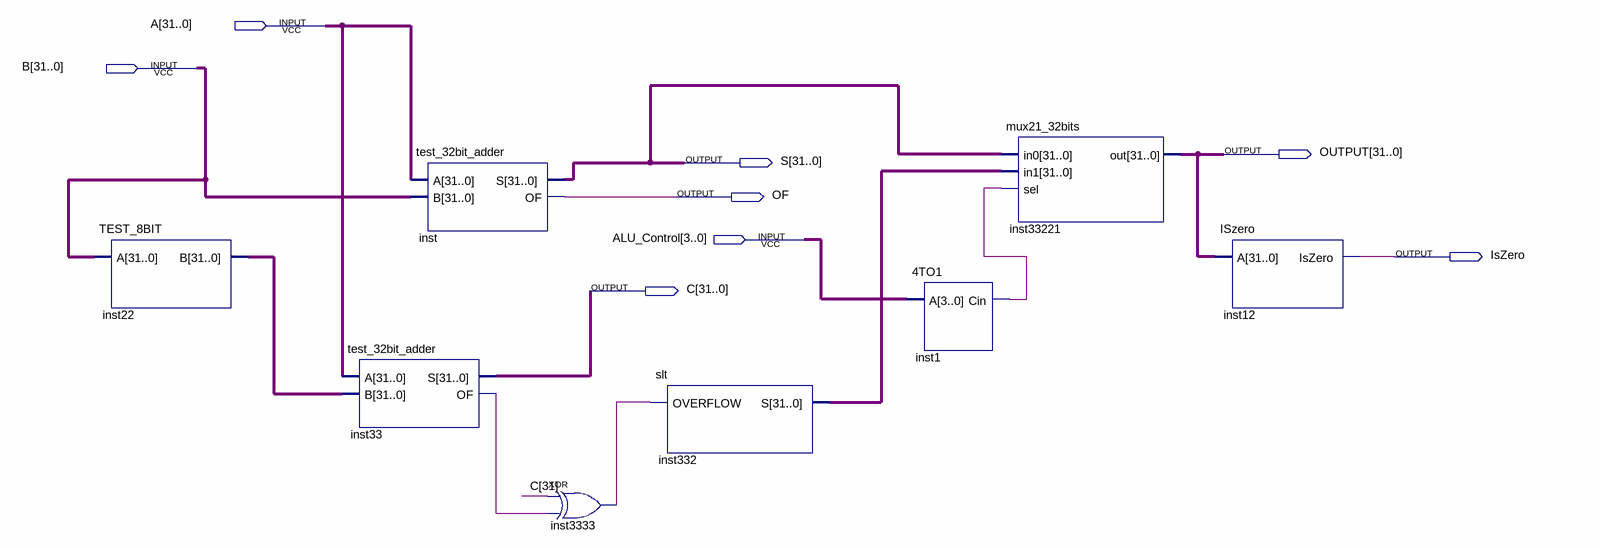
[diagram p0: schematic sheet]
// Quartus schematic ALU.bdf as structural Verilog: 8 symbols, 8 pins
module ALU (
  input  [31:0] A,
  input  [31:0] B,
  input  [3:0] ALU_Control,
  output [31:0] OUTPUT,
  output [31:0] S,
  output OF,
  output IsZero,
  output [31:0] C
);

  wire inst1_cin, inst33_of, inst3333_out;
  wire [31:0] inst22_b, inst332_s;

  TEST_8BIT inst22 (.A(B), .B(inst22_b));
  test_32bit_adder inst33 (.A(A), .B(inst22_b), .S(C), .OF(inst33_of));
  test_32bit_adder inst (.A(A), .B(B), .S(S), .OF(OF));
  xor inst3333 (inst3333_out, C[31], inst33_of);
  slt inst332 (.OVERFLOW(inst3333_out), .S(inst332_s));
  \4TO1  inst1 (.A(ALU_Control), .Cin(inst1_cin));
  mux21_32bits inst33221 (.in0(S), .in1(inst332_s), .sel(inst1_cin), .out(OUTPUT));
  ISzero inst12 (.A(OUTPUT), .IsZero(IsZero));
endmodule
